# EAGLE design 8bit-v0_3 (EAGLE 7.2.0)
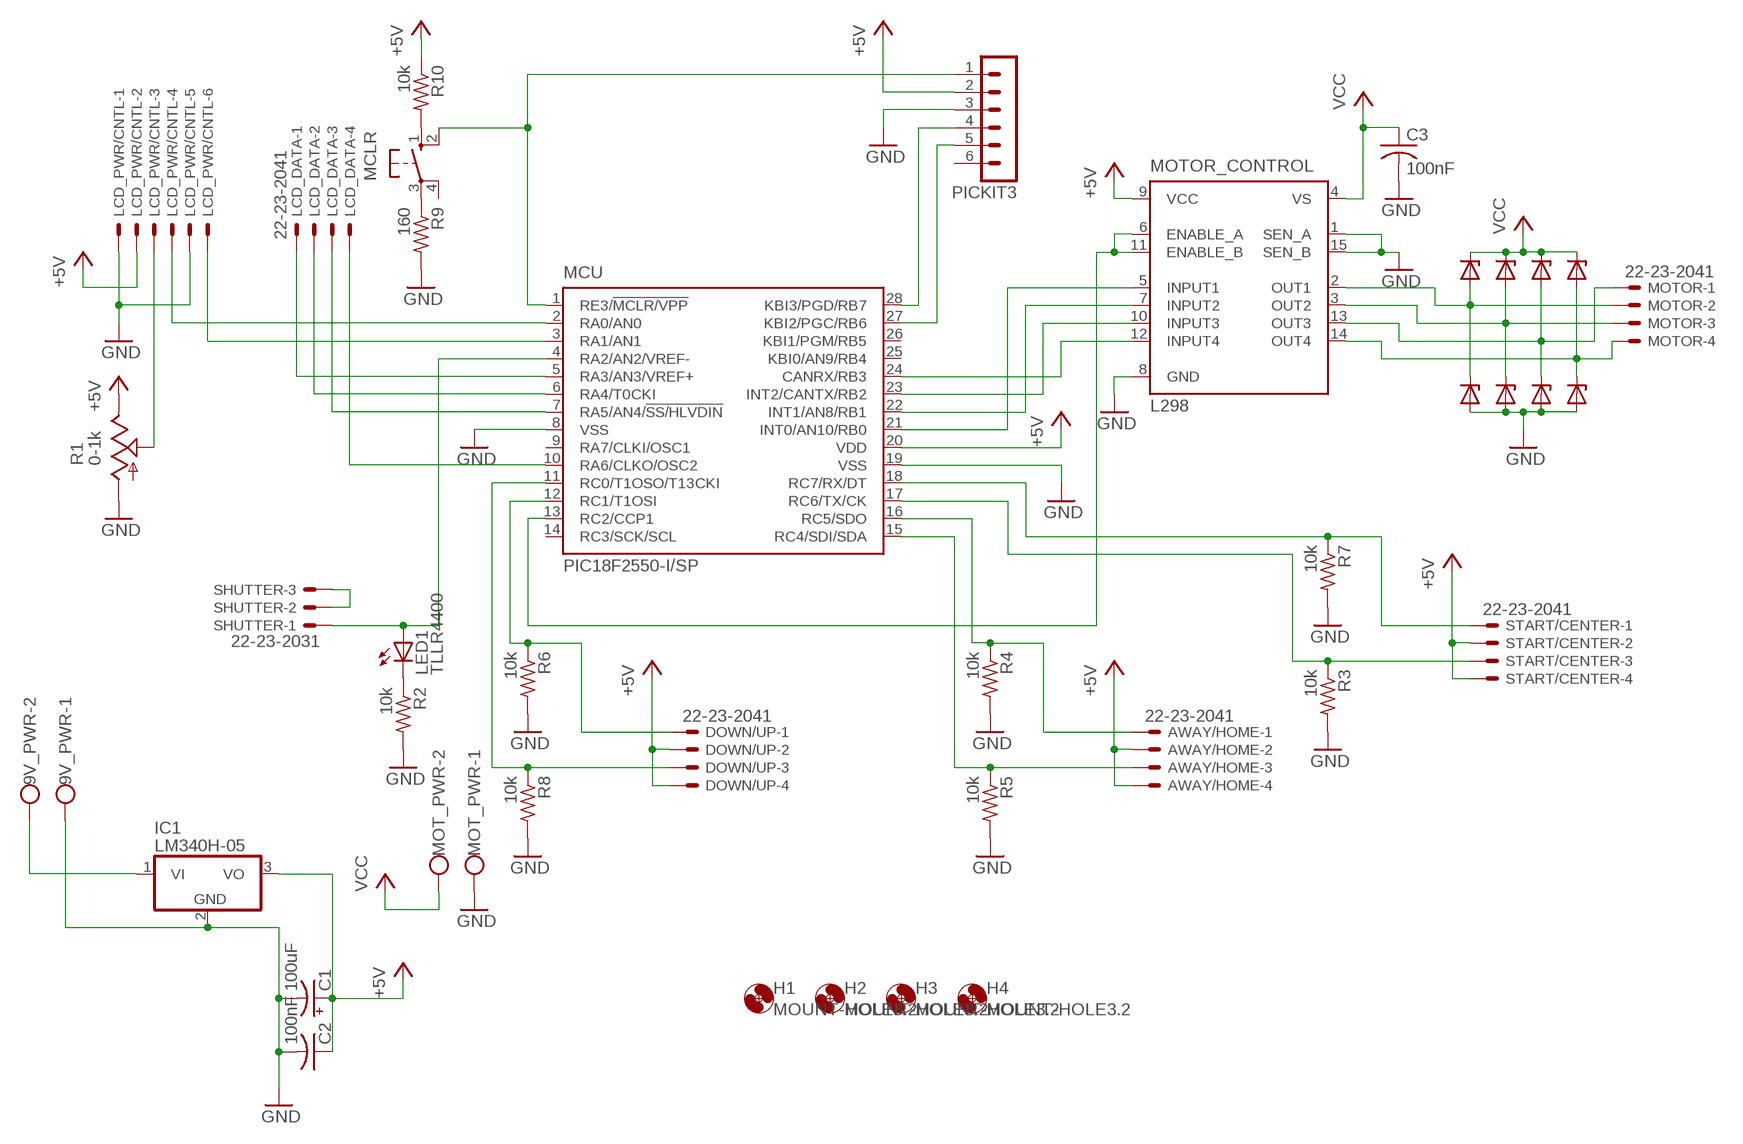
[diagram p0: schematic, sheet 1]

## Parts
9V_PWR  W237-102  [W237-102]
AWAY/HOME  22-23-2041  [22-23-2041]
C1  100uF  CPOL-USE2.5-7  [E2,5-7]
C2  100nF  C-US025-025X050  [C025-025X050]
C3  100nF  C-US025-025X050  [C025-025X050]
D1  BZX90  [DO34Z7]
D2  BZX90  [DO34Z7]
D3  BZX90  [DO34Z7]
D4  BZX90  [DO34Z7]
D5  BZX90  [DO34Z7]
D6  BZX90  [DO34Z7]
D7  BZX90  [DO34Z7]
D8  BZX90  [DO34Z7]
DOWN/UP  22-23-2041  [22-23-2041]
H1  MOUNT-HOLE3.2  [3,2]
H2  MOUNT-HOLE3.2  [3,2]
H3  MOUNT-HOLE3.2  [3,2]
H4  MOUNT-HOLE3.2  [3,2]
IC1  LM340H-05  [TO220H]
LCD_DATA  22-23-2041  [22-23-2041]
LCD_PWR/CNTL  22-23-2061  [22-23-2061]
LED1  TLLR4400  [LED3MM]
MCLR  10-XX  [B3F-10XX]
MCU  PIC18F2580-I/SP  [DIL28-3]
MOT_PWR  W237-102  [W237-102]
MOTOR  22-23-2041  [22-23-2041]
MOTOR_CONTROL  L298  [MULTIWATT-15]
PICKIT3  MA06-1  [MA06-1]
R1  0-1k  TRIM_US-B25P  [B25P]
R2  10k  R-US_0207/10  [0207/10]
R3  10k  R-US_0207/10  [0207/10]
R4  10k  R-US_0207/10  [0207/10]
R5  10k  R-US_0207/10  [0207/10]
R6  10k  R-US_0207/10  [0207/10]
R7  10k  R-US_0207/10  [0207/10]
R8  10k  R-US_0207/10  [0207/10]
R9  160  R-US_0207/10  [0207/10]
R10  10k  R-US_0207/10  [0207/10]
SHUTTER  22-23-2031  [22-23-2031]
START/CENTER  22-23-2041  [22-23-2041]

## Nets
+5V: AWAY/HOME.2 AWAY/HOME.4 C1.+ C2.1 DOWN/UP.2 DOWN/UP.4 IC1.3(VO) LCD_PWR/CNTL.2 MCU.20(VDD) MOTOR_CONTROL.9(VCC) PICKIT3.2 R1.E R10.1 START/CENTER.2 START/CENTER.4
GND: 9V_PWR.1 C1.- C2.2 C3.2 D5.A D6.A D7.A D8.A IC1.2(GND) LCD_PWR/CNTL.1 LCD_PWR/CNTL.5 MCU.8(VSS) MCU.19(VSS) MOT_PWR.1 MOTOR_CONTROL.8(GND) PICKIT3.3 R1.A R2.2 R3.2 R4.2 R5.2 R6.2 R7.2 R8.2 R9.2
N$1: MCLR.2(S1) MCU.1(RE3/!MCLR/VPP) PICKIT3.1
N$2: MCU.27(KBI2/PGC/RB6) PICKIT3.5
N$3: MCU.28(KBI3/PGD/RB7) PICKIT3.4
N$4: LCD_PWR/CNTL.3 R1.S
N$5: MOTOR_CONTROL.1(SEN_A) MOTOR_CONTROL.15(SEN_B) ; supply symbol labelled GND
N$6: MCU.24(CANRX/RB3) MOTOR_CONTROL.12(INPUT4)
N$7: MCU.23(INT2/CANTX/RB2) MOTOR_CONTROL.10(INPUT3)
N$8: MCU.22(INT1/AN8/RB1) MOTOR_CONTROL.7(INPUT2)
N$9: LCD_PWR/CNTL.4 MCU.2(RA0/AN0)
N$10: LCD_PWR/CNTL.6 MCU.3(RA1/AN1)
N$11: LCD_DATA.1 MCU.5(RA3/AN3/VREF+)
N$12: LCD_DATA.3 MCU.7(RA5/AN4/!SS/HLVDIN)
N$13: LCD_DATA.4 MCU.10(RA6/CLKO/OSC2)
N$14: MCU.21(INT0/AN10/RB0) MOTOR_CONTROL.5(INPUT1)
N$15: AWAY/HOME.1 MCU.16(RC5/SDO) R4.1
N$16: D2.A D6.C MOTOR.3 MOTOR_CONTROL.3(OUT2)
N$17: D3.A D7.C MOTOR.1 MOTOR_CONTROL.13(OUT3)
N$18: D4.A D8.C MOTOR.4 MOTOR_CONTROL.14(OUT4)
N$19: AWAY/HOME.3 MCU.15(RC4/SDI/SDA) R5.1
N$20: LCD_DATA.2 MCU.6(RA4/T0CKI)
N$21: MCU.17(RC6/TX/CK) R3.1 START/CENTER.3
N$22: LED1.K(C) R2.1
N$23: DOWN/UP.1 MCU.12(RC1/T1OSI) R6.1
N$24: MCU.18(RC7/RX/DT) R7.1 START/CENTER.1
N$25: DOWN/UP.3 MCU.11(RC0/T1OSO/T13CKI) R8.1
N$28: D1.A D5.C MOTOR.2 MOTOR_CONTROL.2(OUT1)
N$30: MCU.13(RC2/CCP1) MOTOR_CONTROL.6(ENABLE_A) MOTOR_CONTROL.11(ENABLE_B)
N$34: LED1.A MCU.4(RA2/AN2/VREF-) SHUTTER.1
N$35: MCLR.1(S) R10.2
N$36: SHUTTER.2 SHUTTER.3
N$38: MCLR.3(P) R9.1
N$40: 9V_PWR.2 IC1.1(VI)
VCC: C3.1 D1.C D2.C D3.C D4.C MOT_PWR.2 MOTOR_CONTROL.4(VS)
Unconnected: MCLR.4(P1) MCU.9(RA7/CLKI/OSC1) MCU.14(RC3/SCK/SCL) MCU.25(KBI0/AN9/RB4) MCU.26(KBI1/PGM/RB5) PICKIT3.6

## Library data of the parts
9V_PWR MOT_PWR = con-wago-500:W237-102: WAGO SCREW CLAMP; MPN: 237-102; OC_FARNELL: unknown; OC_NEWARK: 70K9898
AWAY/HOME DOWN/UP LCD_DATA MOTOR START/CENTER = con-molex:22-23-2041: .100" (2.54mm) Center Header - 4 Pin; MF: MOLEX; MPN: 22-23-2041; OC_FARNELL: 1462920; OC_NEWARK: 38C0355
C1 = rcl:CPOL-US: POLARIZED CAPACITOR, American symbol
C2 C3 = rcl:C-US: CAPACITOR, American symbol
D1-D8 = diode:BZX90: Z DIODE
H1-H4 = holes:MOUNT-HOLE: MOUNTING HOLE with drill center marker
IC1 = linear:LM340?-*: Positive VOLTAGE REGULATOR Source: http://cache.national.com/ds/LM/LM340.pdf
LCD_PWR/CNTL = con-molex:22-23-2061: .100" (2.54mm) Center Header - 6 Pin; MF: MOLEX; MPN: 22-23-2061; OC_FARNELL: 1462922; OC_NEWARK: 27C1933
LED1 = led:TLLR4400: Low Current (2mA) LED 3 mm Tinted Diffused Package color RED Source: Data sheet <http://www.farnell.com/datasheets/391100.pdf>; MF: VISHAY SEMICONDUCTOR; OC_FARNELL: 1612437
MCLR = switch-omron:10-XX: OMRON SWITCH; MPN: B3F-1000; OC_FARNELL: 176432; OC_NEWARK: 36M3542
MCU = microchip:PIC18F2*80: 28-Pin Enhanced Flash Microcontrollers with ECAN(TM) Technology 10-Bit A/D and nanoWatt Technology Source: http://www.microchip.com .. 39637a.pdf; MF: MICROCHIP; MPN: PIC18F2550-I/SP; OC_FARNELL: 9321276; OC_NEWARK: 71J7244
MOTOR_CONTROL = st-microelectronics:L298: DUAL FULL-BRIDGE DRIVER; MPN: L298N; OC_FARNELL: 1589425; OC_NEWARK: 32M1527
PICKIT3 = con-lstb:MA06-1: PIN HEADER; OC_FARNELL: unknown; OC_NEWARK: unknown
R1 = pot:TRIM_US-: POTENTIOMETER
R2-R10 = rcl:R-US_: RESISTOR, American symbol
SHUTTER = con-molex:22-23-2031: .100" (2.54mm) Center Header - 3 Pin; MF: MOLEX; MPN: 22-23-2031; OC_FARNELL: 1462950; OC_NEWARK: 30C0862

## Board
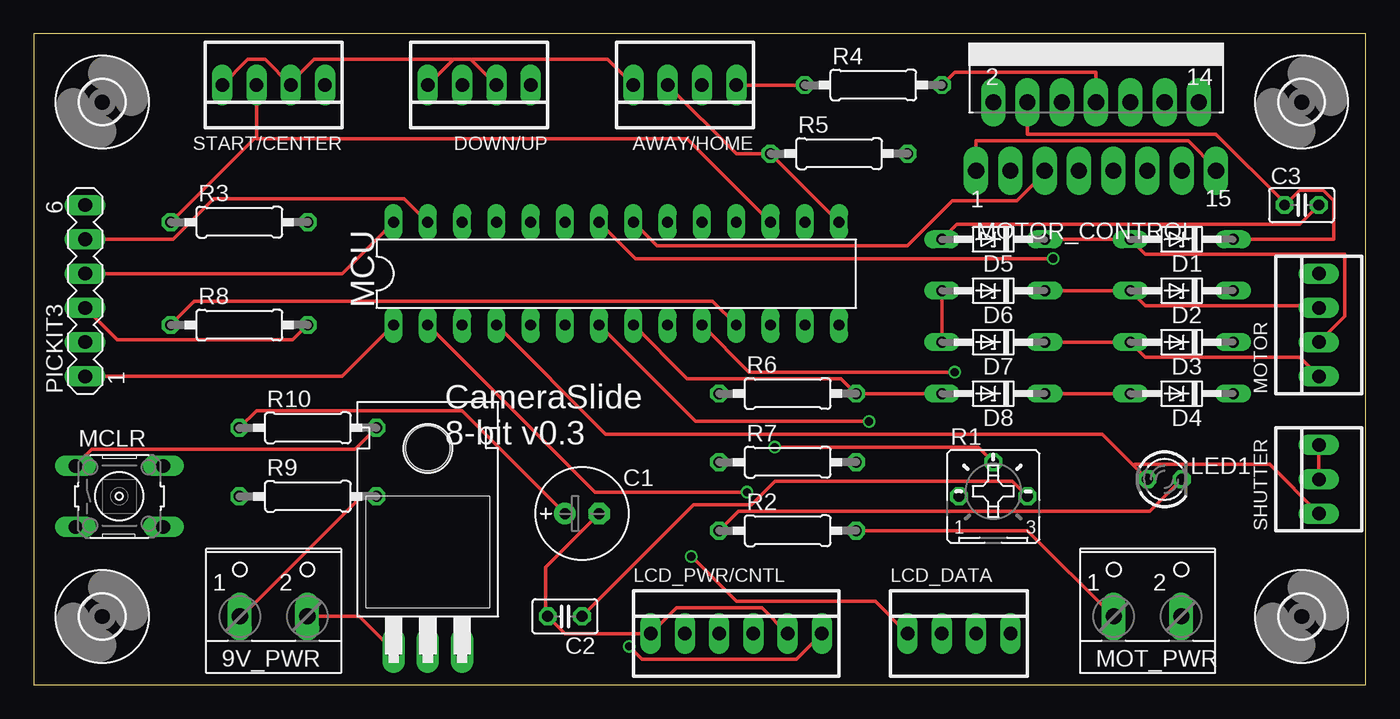
[diagram p1: board, top side]
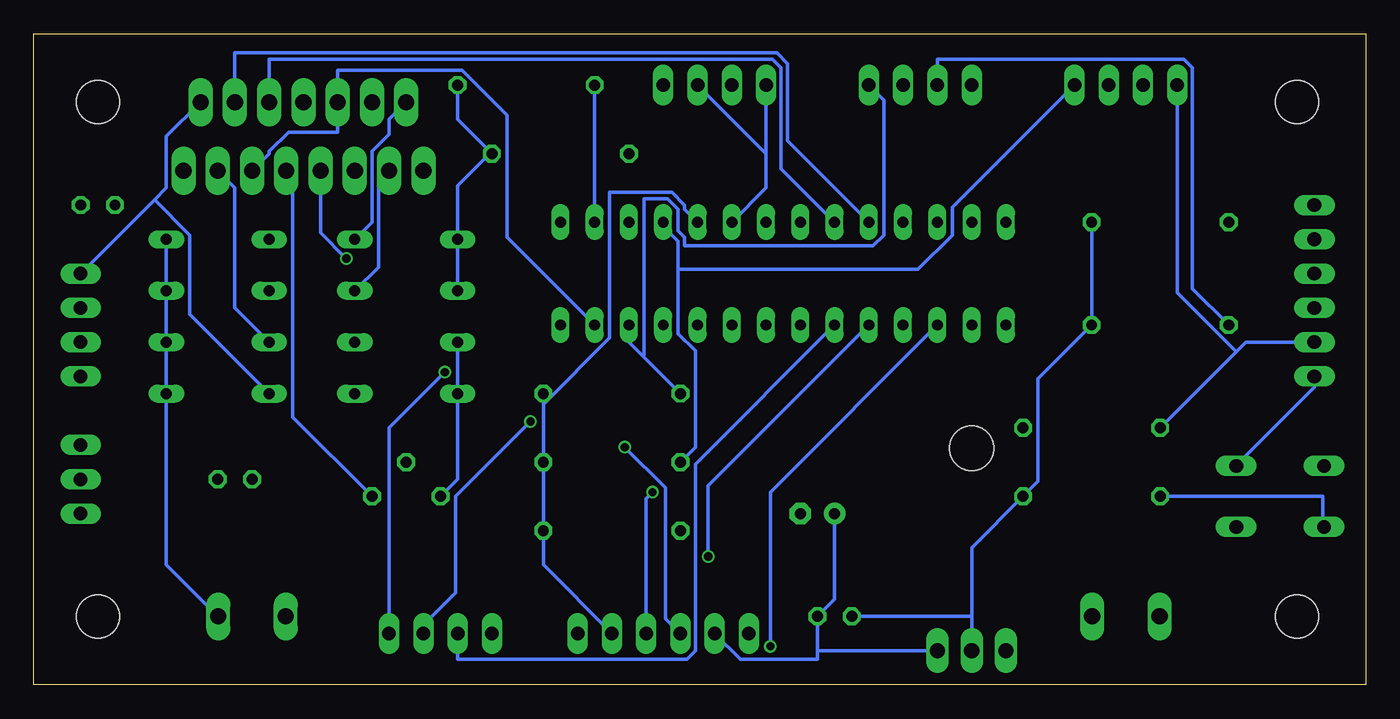
[diagram p2: board, bottom side, seen from below]

Size 98.73 x 48.25 mm. Coordinates in mm from the lower left corner, seen from the top.
Outline: 0,0 98.73,0 98.73,48.25 0,48.25 0,0
Copper layers (1*16): Top 0.035mm / dielectric 1.5mm / Bottom 0.035mm
Design rules "ITEADstudio_DRC": minimum track width 6mil, minimum drill 12mil, track to track 6mil, track to pad 6mil, pad to pad 6mil, via to via 6mil, smd to smd 0mil, copper to edge 10mil, drill to drill 10mil, minimum pad ring 10mil, minimum via ring 6mil, stop-mask expansion 2mil, vias tented up to drill 100mil, thermal gap 10mil

### Footprints (pad centres in the part's own frame; a part is rotated, then mirrored left to right if it is on the bottom)
W237-102 = drill 1.194 long: 1 -2.5,-1.27; 2 2.5,-1.27
22-23-2041 = drill 1 long: 1 -3.81,0; 2 -1.27,0; 3 1.27,0; 4 3.81,0
E2,5-7 = drill 0.813 pad 1.6: + -1.27,0 | drill 0.813 pad 1.6 octagon: - 1.27,0
C025-025X050 = drill 0.813 octagon: 1 -1.27,0; 2 1.27,0
DO34Z7 = drill 0.813 long: A 3.81,0; C -3.81,0
3,2 = hole 3.2: 0,0
TO220H = drill 1.118 long: 1 -2.54,-10.16; 2 0,-10.16; 3 2.54,-10.16 | hole 3.302: 0,4.826
22-23-2061 = drill 1 long: 1 -6.35,0; 2 -3.81,0; 3 -1.27,0; 4 1.27,0; 5 3.81,0; 6 6.35,0
LED3MM = drill 0.813 octagon: A -1.27,0; K 1.27,0
B3F-10XX = drill 1.016 long: 1 -3.251,2.261; 2 3.251,2.261; 3 -3.251,-2.261; 4 3.251,-2.261
DIL28-3 = drill 0.813 long: 1 -16.51,-3.81; 2 -13.97,-3.81; 3 -11.43,-3.81; 4 -8.89,-3.81; 5 -6.35,-3.81; 6 -3.81,-3.81; 7 -1.27,-3.81; 8 1.27,-3.81; 9 3.81,-3.81; 10 6.35,-3.81; 11 8.89,-3.81; 12 11.43,-3.81; 13 13.97,-3.81; 14 16.51,-3.81; 15 16.51,3.81; 16 13.97,3.81; 17 11.43,3.81; 18 8.89,3.81; 19 6.35,3.81; 20 3.81,3.81; 21 1.27,3.81; 22 -1.27,3.81; 23 -3.81,3.81; 24 -6.35,3.81; 25 -8.89,3.81; 26 -11.43,3.81; 27 -13.97,3.81; 28 -16.51,3.81
MULTIWATT-15 = drill 1.2 long: 1 -8.89,-7.62; 2 -7.62,-2.54; 3 -6.35,-7.62; 4 -5.08,-2.54; 5 -3.81,-7.62; 6 -2.54,-2.54; 7 -1.27,-7.62; 8 0,-2.54; 9 1.27,-7.62; 10 2.54,-2.54; 11 3.81,-7.62; 12 5.08,-2.54; 13 6.35,-7.62; 14 7.62,-2.54; 15 8.89,-7.62
MA06-1 = drill 1.016 long: 1 -6.35,0; 2 -3.81,0; 3 -1.27,0; 4 1.27,0; 5 3.81,0; 6 6.35,0
B25P = drill 0.813 octagon: A -2.54,0; E 2.54,0; S 0,2.54
0207/10 = drill 0.813 octagon: 1 -5.08,0; 2 5.08,0
22-23-2031 = drill 1 long: 1 -2.54,0; 2 0,0; 3 2.54,0

### Placement (x,y rotation side)
9V_PWR  17.78,6.35 0 top
AWAY/HOME  48.26,44.45 180 top
C1  40.64,12.7 0 top
C2  39.37,5.08 180 top
C3  93.98,35.56 0 top
D1  85.09,33.02 180 top
D2  85.09,29.21 180 top
D3  85.09,25.4 180 top
D4  85.09,21.59 180 top
D5  71.12,33.02 180 top
D6  71.12,29.21 180 top
D7  71.12,25.4 180 top
D8  71.12,21.59 180 top
DOWN/UP  33.02,44.45 180 top
H1  5.08,5.08 0 top
H2  93.98,43.18 0 top
H3  5.08,43.18 0 top
H4  93.98,5.08 0 top
IC1  29.21,12.7 0 top
LCD_DATA  68.58,3.81 0 top
LCD_PWR/CNTL  52.07,3.81 0 top
LED1  83.82,15.24 0 top
MCLR  6.35,13.97 0 top
MCU  43.18,30.48 0 top
MOT_PWR  82.55,6.35 0 top
MOTOR  95.25,26.67 90 top
MOTOR_CONTROL  78.74,45.72 0 top
PICKIT3  3.81,29.21 90 top
R1  71.12,13.97 0 top
R2  55.88,11.43 0 top
R3  15.24,34.29 0 top
R4  62.23,44.45 0 top
R5  59.69,39.37 0 top
R6  55.88,21.59 0 top
R7  55.88,16.51 0 top
R8  15.24,26.67 0 top
R9  20.32,13.97 0 top
R10  20.32,19.05 0 top
SHUTTER  95.25,15.24 90 top
START/CENTER  17.78,44.45 180 top

### Tracks (layer width: path | path; a pad name or v marks a point on that pad's centre or on a via)
+5V
  Top 0.254: START/CENTER.4 15.88,46.35 17.14,46.35 START/CENTER.2 19.05,44.61 20.8,46.35 30.96,46.35 31.04,46.28 | 31.04,46.28 31.11,46.35 32.38,46.35 32.46,46.28 | 31.04,46.28 DOWN/UP.4 | DOWN/UP.2 32.46,46.28 | AWAY/HOME.4 42.55,46.35 32.54,46.35 32.46,46.28 | C1.+ 31.75,20.32 16.51,20.32 R10.1 | R1.E 72.55,15.08 54.93,15.08 53.18,13.34 48.9,13.34 C2.1
  Bottom 0.254: R1.E 79.53,19.84 79.53,37.62 MOTOR_CONTROL.9 | C1.+ 39.37,6.35 C2.1 40.64,2.54 | LCD_PWR/CNTL.2 46.35,1.91 40.64,1.91 40.64,2.54 | 40.64,2.54 IC1.3 | 9.6,24.69 8.89,25.4 PICKIT3.2 | 9.6,24.69 R10.1 | MCU.20 44.45,36.83 44.45,39.37 | AWAY/HOME.4 44.45,39.37 | 44.45,39.37 AWAY/HOME.2 | 9.6,24.69 13.97,29.05 START/CENTER.4
GND
  Top 0.254: PICKIT3.3 6.19,25.56 19.21,25.56 R8.2 | C1.- 37.94,8.73 37.94,5.08 C2.2 39.37,3.81 LCD_PWR/CNTL.1 47.62,5.71 53.98,5.71 LCD_PWR/CNTL.5 | R9.2 24.29,13.97 15.4,5.08 9V_PWR.1 | MOTOR_CONTROL.8 78.74,45.4 68.26,45.4 R4.2 | D7.A D6.A | C3.2 93.82,34.13 68.42,34.13 D5.A | MCU.8 48.42,22.7 59.85,22.7 R6.2 D8.A | R2.2 73.66,11.43 80.01,5.08 MOT_PWR.1
  Bottom 0.254: R3.2 R8.2 24.29,22.7 24.29,15.08 R9.2 29.21,10.16 29.21,5.08 | IC1.2 29.21,5.08 | 29.21,5.08 C2.2 | R4.2 67.31,41.91 R5.2 64.93,39.37 67.31,36.99 D5.A D6.A | D7.A D8.A 67.31,15.24 R1.A | 60.96,20.8 R7.2 R2.2 60.96,8.89 LCD_PWR/CNTL.5 | 60.96,20.8 R6.2 | MCU.19 50.48,35.24 50.48,35.56 51.44,36.51 56.04,36.51 56.04,25.72 60.96,20.8
N$1
  Top 0.254: MCU.1 22.86,22.86 PICKIT3.1
  Bottom 0.254: PICKIT3.1 3.81,22.07 9.53,16.35 MCLR.2
N$2
  Top 0.254: MCU.27 27.46,36.04 13.34,36.04 10.32,33.02 PICKIT3.5
N$3
  Top 0.254: MCU.28 22.86,30.48 PICKIT3.4
N$4  (via drill 0.61)
  Top 0.254: R1.S 70.01,17.62 v54.93,17.62
  Bottom 0.254: v54.93,17.62 51.91,14.61 51.91,4.92 LCD_PWR/CNTL.3
N$5
  Top 0.254: MOTOR_CONTROL.1 69.85,40.32 85.57,40.32 87.63,38.26 MOTOR_CONTROL.15
N$6
  Bottom 0.254: MCU.24 42.86,40.32 42.86,46.04 43.66,46.83 83.82,46.83 MOTOR_CONTROL.12
N$7
  Bottom 0.254: MCU.23 43.34,38.26 43.34,45.72 43.97,46.35 81.28,46.35 MOTOR_CONTROL.10
N$8  (via drill 0.61)
  Top 0.254: MCU.22 44.61,31.59 v75.56,31.59
  Bottom 0.254: v75.56,31.59 77.47,33.5 MOTOR_CONTROL.7
N$9  (via drill 0.61)
  Top 0.254: MCU.2 41.59,14.29 v52.86,14.29
  Bottom 0.254: v52.86,14.29 53.34,13.81 LCD_PWR/CNTL.4
N$10  (via drill 0.61)
  Top 0.254: v44.13,2.86 45.09,1.91 56.52,1.91 LCD_PWR/CNTL.6
  Bottom 0.254: MCU.3 44.13,14.29 v44.13,2.86
N$11  (via drill 0.61)
  Top 0.254: v48.74,9.53 52.07,6.19 62.39,6.19 LCD_DATA.1
  Bottom 0.254: MCU.5 48.74,14.76 v48.74,9.53
N$12  (via drill 0.61)
  Top 0.254: MCU.7 49.05,19.53 v61.91,19.53
  Bottom 0.254: v61.91,19.53 67.47,13.97 67.47,6.83 69.85,4.45 LCD_DATA.3
N$13  (via drill 0.61)
  Top 0.254: MCU.10 53.02,23.18 v68.26,23.18
  Bottom 0.254: v68.26,23.18 72.39,19.05 LCD_DATA.4
N$14
  Top 0.254: MCU.21 46.2,32.54 64.77,32.54 68.1,35.88 72.87,35.88 74.93,37.94 MOTOR_CONTROL.5
N$15
  Top 0.254: R4.1 AWAY/HOME.1
  Bottom 0.254: R4.1 MCU.16
N$16
  Top 0.254: D6.C D2.A 82.39,28.1 95.09,28.1 MOTOR.3
  Bottom 0.254: MOTOR_CONTROL.3 73.18,37.31 73.18,30.96 D6.C
N$17
  Top 0.254: D7.C D3.A 82.39,24.29 93.82,24.29 MOTOR.1
  Bottom 0.254: MOTOR_CONTROL.13 83.82,36.83 83.82,27.94 D3.A
N$18
  Top 0.254: D4.A D8.C
  Bottom 0.254: 89.77,35.96 88.9,36.83 88.9,40.64 MOTOR_CONTROL.14 | 89.77,35.96 MOTOR.4 | D4.A 87.15,27.46 87.15,33.34 89.77,35.96
N$19
  Top 0.254: MCU.15 R5.1 52.07,39.37 AWAY/HOME.3
N$20
  Bottom 0.254: MCU.6 49.69,16.35 49.69,2.54 50.32,1.91 67.31,1.91 LCD_DATA.2
N$21
  Top 0.254: 16.43,40.56 16.51,40.64 START/CENTER.3 | 16.43,40.56 R3.1 | MCU.17 48.42,40.48 16.51,40.48 16.43,40.56
N$22
  Top 0.254: R2.1 52.23,12.86 82.71,12.86 LED1.K
N$23
  Bottom 0.254: 53.58,24.37 54.61,25.4 MCU.12 | 53.58,24.37 R6.1 | DOWN/UP.1 35.72,43.34 35.72,33.34 36.51,32.54 50.48,32.54 50.48,33.18 50.96,33.66 50.96,35.24 51.75,36.04 53.5,36.04 53.5,24.45 53.58,24.37
N$24
  Bottom 0.254: R7.1 49.69,17.62 49.69,24.77 50.96,26.04 50.96,30.8 | 50.96,30.8 50.96,32.86 52.07,33.97 MCU.18 | START/CENTER.1 30.64,35.4 30.64,33.34 33.18,30.8 50.96,30.8
N$25
  Top 0.254: MCU.11 50.32,28.42 11.91,28.42 R8.1
  Bottom 0.254: R8.1 12.86,29.37 12.86,45.72 13.49,46.35 31.75,46.35 DOWN/UP.3
N$28
  Top 0.254: D5.C D1.A 82.39,31.91 97.16,31.91 97.16,27.3 MOTOR.2
  Bottom 0.254: MOTOR_CONTROL.2 72.39,41.91 72.39,40.8 73.66,39.53 73.66,34.29 D5.C
N$30
  Bottom 0.254: MCU.13 63.66,33.18 63.66,42.23 66.99,45.56 76.2,45.56 MOTOR_CONTROL.6 76.2,40.96 79.85,40.96 81.28,39.53 81.28,39.37 MOTOR_CONTROL.11
N$34
  Top 0.254: MCU.4 42.39,18.57 79.22,18.57 81.52,16.27 | LED1.A 81.52,16.27 | SHUTTER.1 91.6,16.35 81.6,16.35 81.52,16.27
N$35
  Top 0.254: R10.2 23.81,17.46 4.29,17.46 3.17,16.35 MCLR.1
N$36
  Top 0.254: SHUTTER.3 SHUTTER.2
N$38
  Bottom 0.254: R9.1 3.17,13.97 3.17,11.75 MCLR.3
N$40
  Top 0.254: IC1.1 24.13,5.08 9V_PWR.2
VCC
  Top 0.254: D1.C 96.36,33.02 96.36,35.88 95.57,36.67 93.82,36.67 C3.1 92.71,35.72 87.63,40.8 73.66,40.8 MOTOR_CONTROL.4
  Bottom 0.254: MOT_PWR.2 85.09,5.08 88.9,8.89 D4.C D3.C D2.C D1.C

### Text on the board
tPlace: CameraSlide / 8-bit v0.3